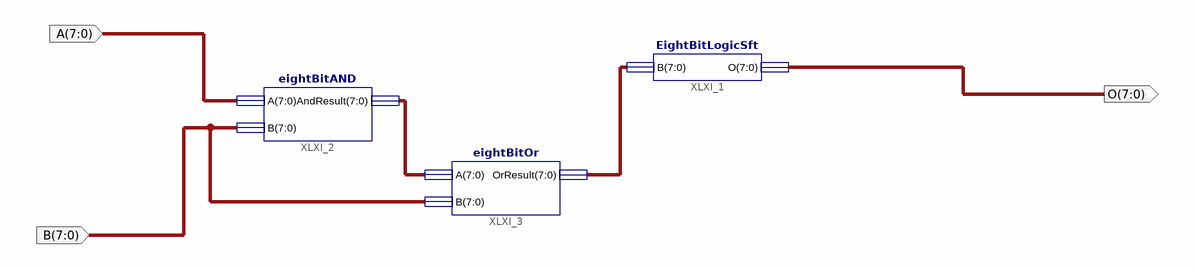
[diagram p0: schematic sheet 1]
// Xilinx ISE schematic RealEightBitSft.sch (spartan6) as structural Verilog: 3 symbols, 3 ports
module RealEightBitSft (
  input  [7:0] A,
  input  [7:0] B,
  output [7:0] O
);

  wire [7:0] XLXN_9, XLXN_10;

  EightBitLogicSft XLXI_1 (.B(XLXN_10), .O(O));
  eightBitAND XLXI_2 (.A(A), .B(B), .AndResult(XLXN_9));
  eightBitOr XLXI_3 (.A(XLXN_9), .B(B), .OrResult(XLXN_10));
endmodule
